# Altium schematic sheet 9046.SchDoc
size A2
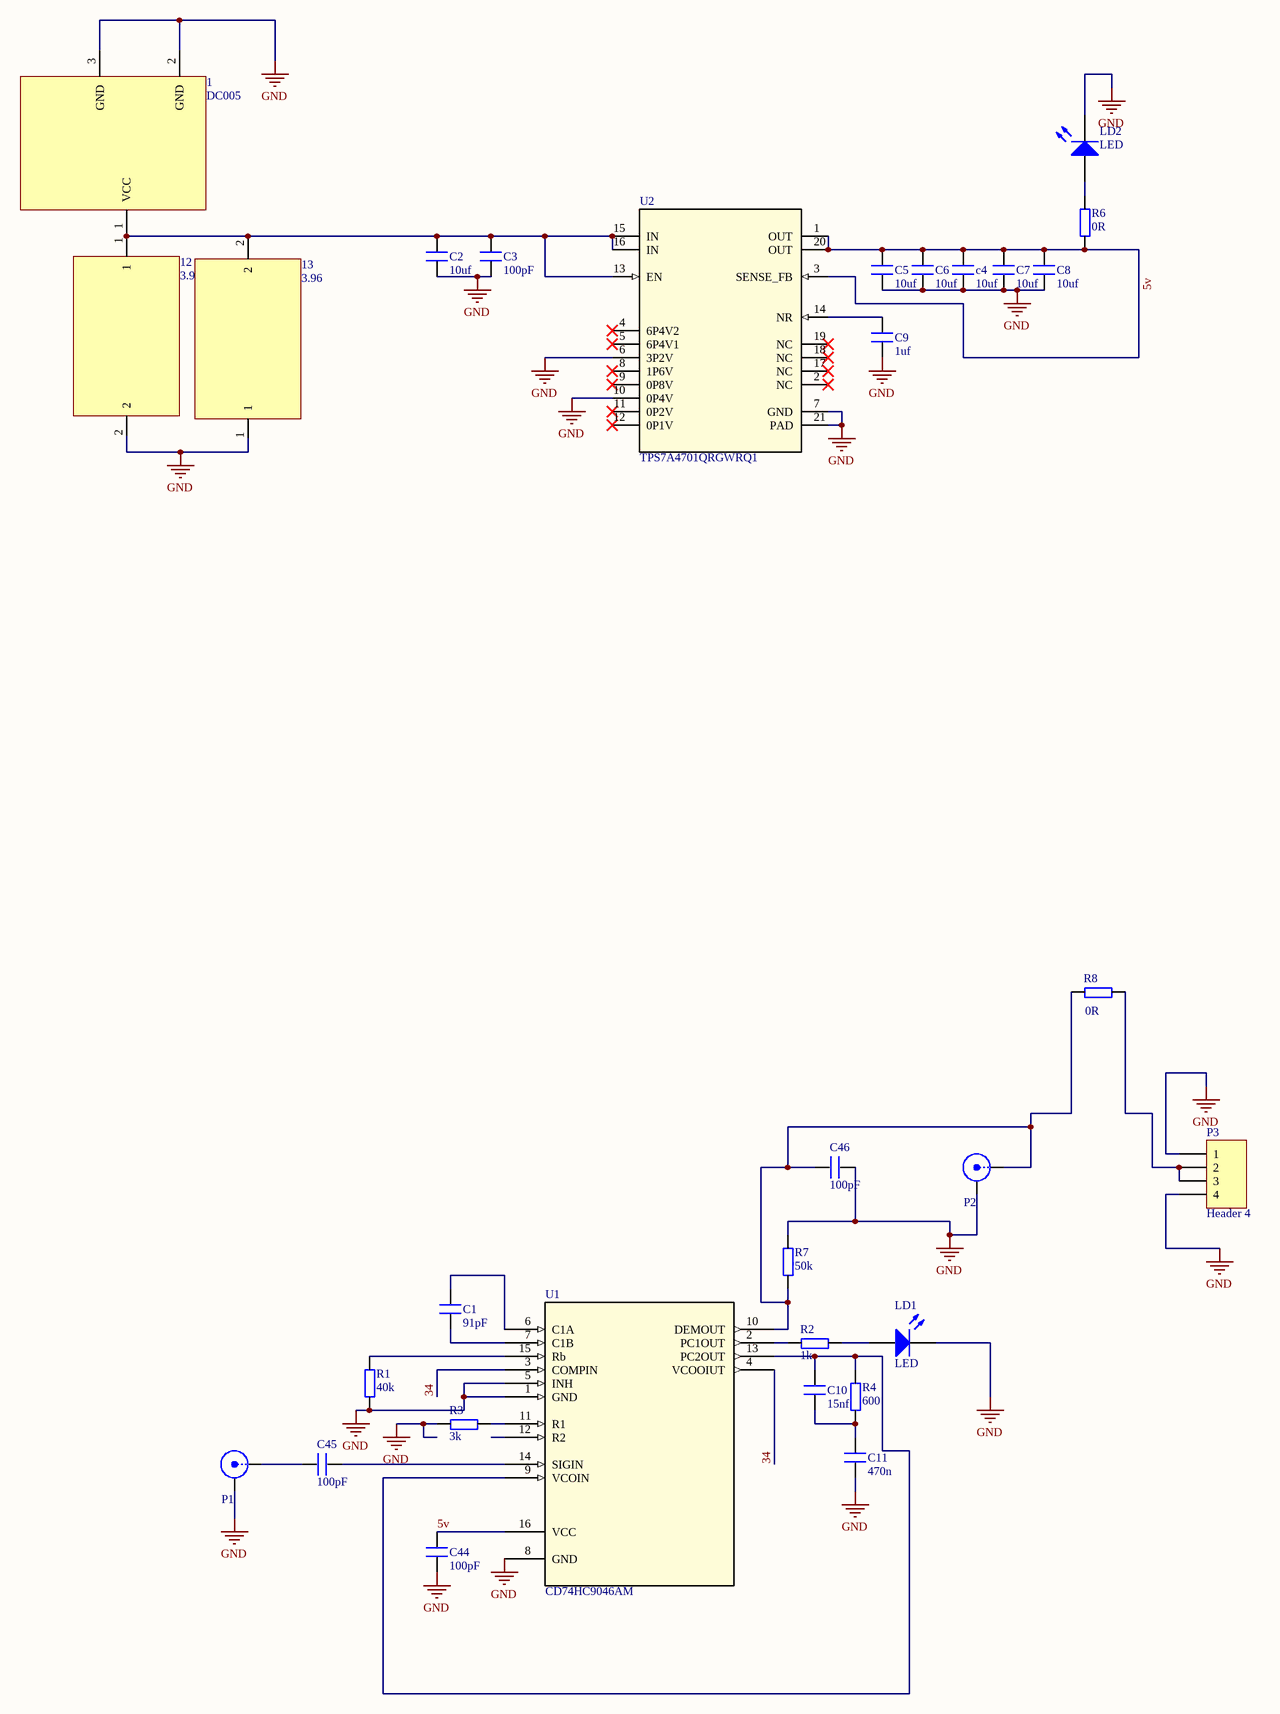
[diagram p0: 9046.SchDoc]

## Parts
1  DC005  [DC10B]
12  3.96  [3.96]
13  3.96  [3.96]
C1  91pF  [0603C]
C2  10uf  [0603C]
C3  100pF  [0603C]
c4  10uf  [0603C]
C5  10uf  [0603C]
C6  10uf  [0603C]
C7  10uf  [0603C]
C8  10uf  [0603C]
C9  1uf  [0603C]
C10  15nf  [0603C]
C11  470n  [0603C]
C44  100pF  [0603C]
C45  100pF  [0603C]
C46  100pF  [0603C]
LD1  LED  [SMDLED]
LD2  LED  [SMDLED]
P1  SMA  [SMA]  (value not drawn)
P2  SMA  [SMA]  (value not drawn)
P3  Header 4  [HDR1X4]
R1  40k  [0603R]
R2  1k  [0603R]
R3  3k  [0603R]
R4  600  [0603R]
R6  0R  [0603R]
R7  50k  [0603R]
R8  0R  [0603R]
U1  CD74HC9046AM  [D16]
U2  TPS7A4701QRGWRQ1  [RGW0020A]

## Nets
GND: 1.2(GND) 1.3(GND) 12.2 13.1 C2.1 C3.1 c4.1 C5.1 C6.1 C7.1 C8.1 C9.1 C11.2 C44.1 C46.2 LD1.2(K) LD2.2(K) P1.2(Y) P2.2(Y) P3.1 P3.4 R1.1 R3.1 R7.2 U1.1(GND) U1.5(INH) U1.8(GND) U2.6(3P2V) U2.7(GND) U2.10(0P4V) U2.21(PAD)
5v: c4.2 C5.2 C6.2 C7.2 C8.2 C44.2 R6.1 U1.16(VCC) U2.1(OUT) U2.3(SENSE_FB) U2.20(OUT)
34: U1.3(COMPIN) U1.4(VCOOIUT)
Net1_1: 1.1(VCC) 12.1 13.2 C2.2 C3.2 U2.13(EN) U2.15(IN) U2.16(IN)
NetC1_1: C1.1 U1.7(C1B)
NetC1_2: C1.2 U1.6(C1A)
NetC9_2: C9.2 U2.14(NR)
NetC10_1: C10.1 R4.2 U1.9(VCOIN) U1.13(PC2OUT)
NetC10_2: C10.2 C11.1 R4.1
NetC45_1: C45.1 P1.1(X)
NetC45_2: C45.2 U1.14(SIGIN)
NetC46_1: C46.1 P2.1(X) R7.1 R8.1 U1.10(DEMOUT)
NetLD1_1: LD1.1(A) R2.2
NetLD2_1: LD2.1(A) R6.2
NetP3_2: P3.2 P3.3 R8.2
NetR1_2: R1.2 U1.15(Rb)
NetR2_1: R2.1 U1.2(PC1OUT)
NetR3_2: R3.2 U1.11(R1)

Not connected (* = marked no-connect by the designer): U1 12(R2); U2 2(NC)* 4(6P4V2)* 5(6P4V1)* 8(1P6V)* 9(0P8V)* 11(0P2V)* 12(0P1V)* 17(NC)* 18(NC)* 19(NC)*

## Library data of the parts
C1-C3 c4 C5-C11 C44-C46 = C: Capacitor
LD1 LD2 = LED: Typical RED, GREEN, YELLOW, AMBER GaAs LED; Published: 8-Jun-2000; LatestRevisionDate: 17-Jul-2002; LatestRevisionNote: Re-released for DXP Platform.; PackageDocument: Feb-2002; PackageReference: 3.2X1.6X1.1; Publisher: Altium Limited
P1 P2 = SMA: SMA Connector
P3 = Header 4: Header, 4-Pin; LatestRevisionDate: 17-Jul-2002; LatestRevisionNote: Re-released for DXP Platform.; Publisher: Altium Limited
R1-R4 R6-R8 = Resistor
U1 = CD74HC9046AM: High Speed CMOS Logic Phase-Locked Loop with VCO and Lock Detector; Manufacturer: Texas Instruments; GENERIC_PART_NUMBER: CD74HC7046A; INDUSTRY_STD_PKG_TYPE: SOIC; FAMILY_NAME: PHASE-LOCKED-LOOP/OSCILLATOR; PIN_COUNT: 16; PACKAGE_DESIGNATOR: D; Datasheet_URL: http://www.ti.com/lit/gpn/CD74HC7046A; Copyright: Copyright (C) 2018 Accelerated Designs. All rights reserved; RefDes: RefDes; Type: DEV
U2 = TPS7A4701QRGWRQ1: No Description Available; Manufacturer: Texas Instruments; PartNumber: TPS7A4701QRGWRQ1; RefDes: RefDes; Type: DEV; Value: Value; Copyright: Copyright (C) 2018 Accelerated Designs. All rights reserved